# EAGLE design BeeMonitor (EAGLE 7.7.0)
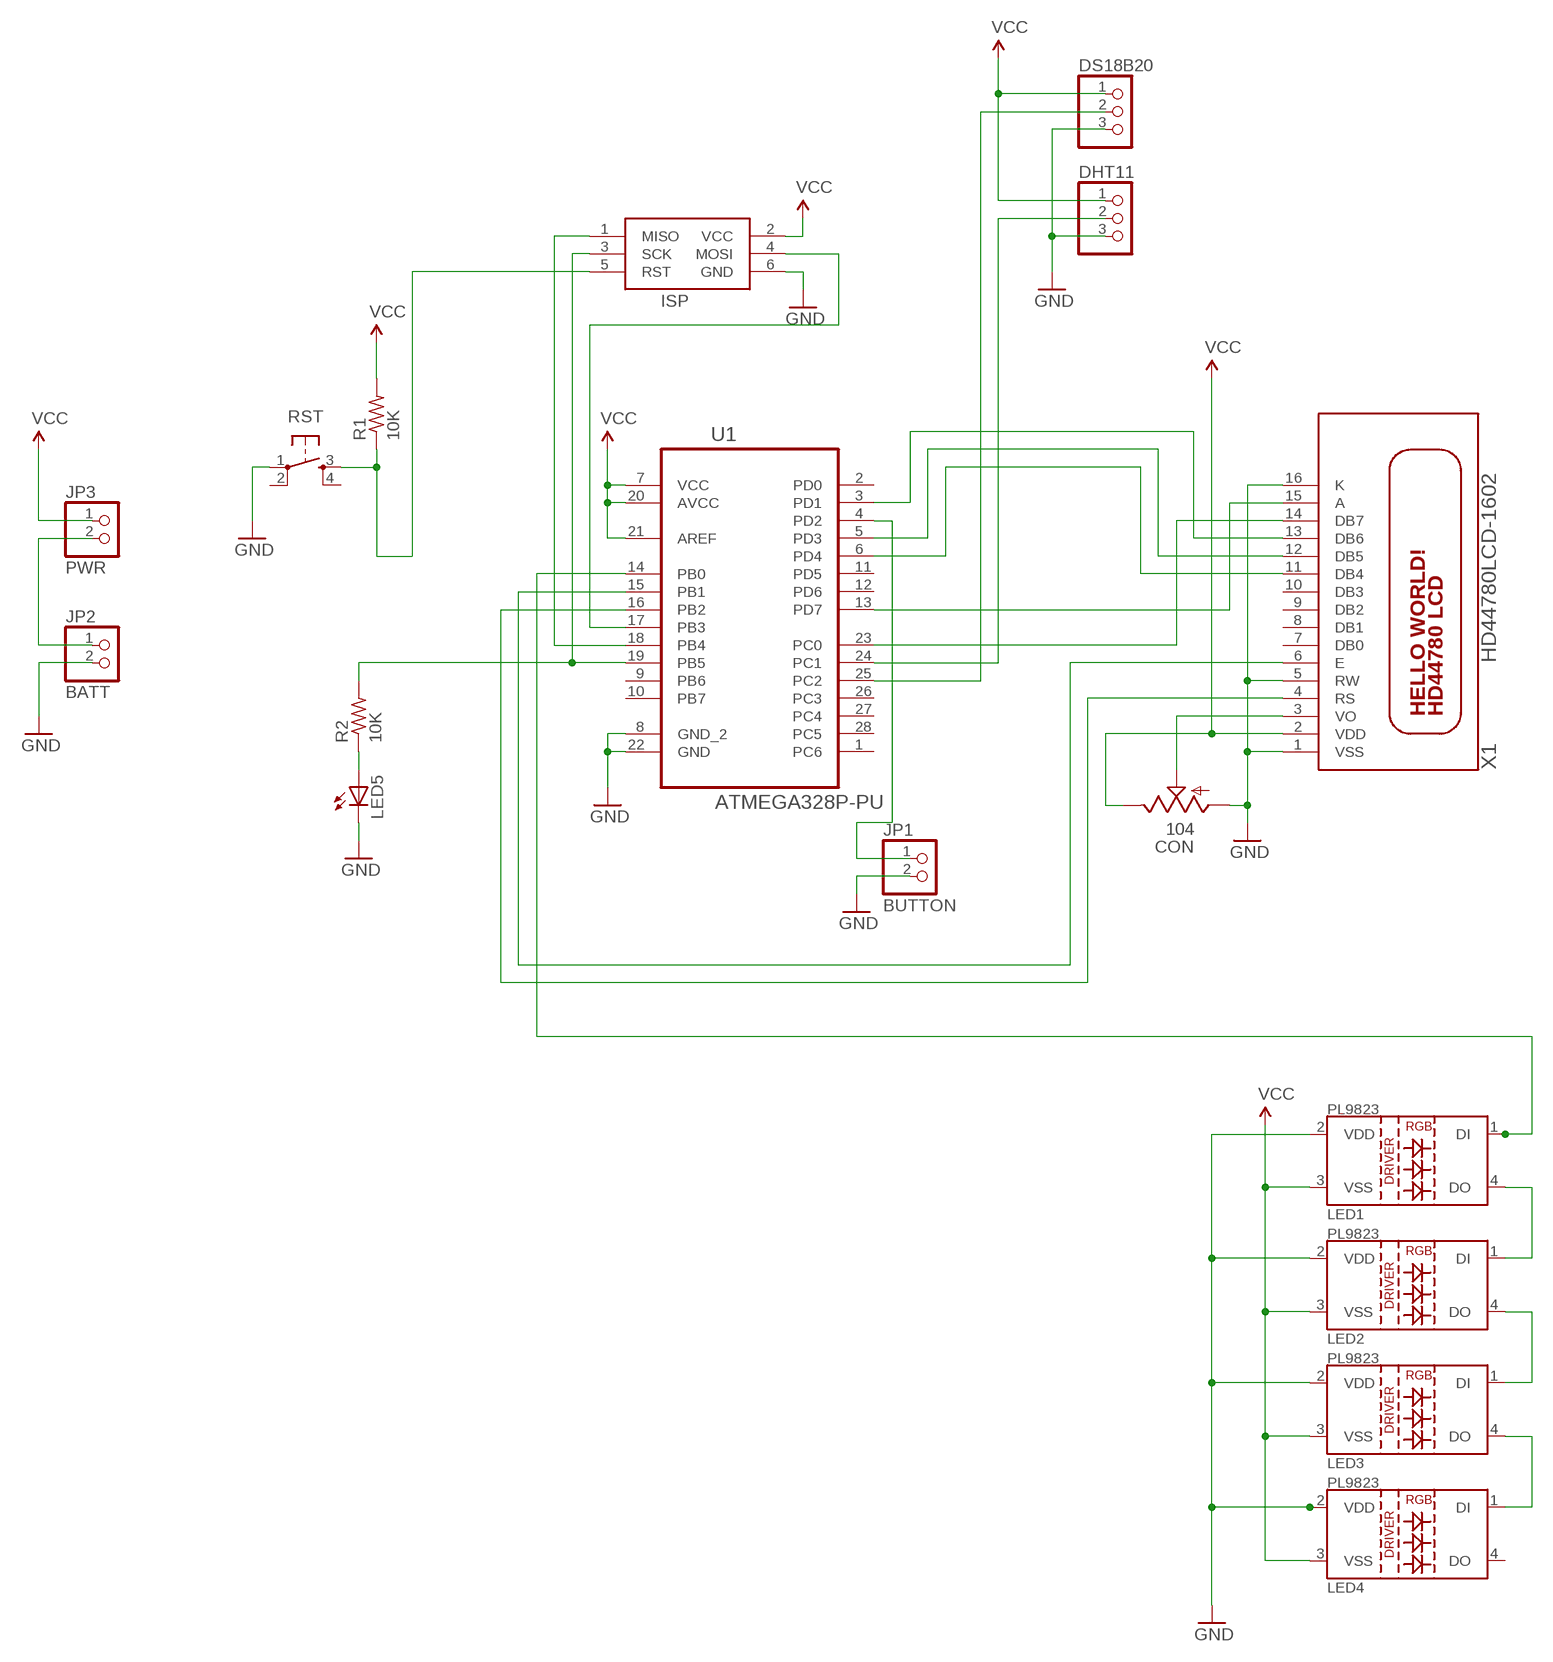
[diagram p0: schematic, sheet 1]

## Parts
CON  104  TRIM  [6MM]
DHT11  PINHD-1X3  [1X03]
DS18B20  PINHD-1X3  [1X03]
ISP  AVRISP-6  [AVRISP]
JP1  BUTTON  PINHD-1X2  [1X02]
JP2  BATT  PINHD-1X2  [1X02]
JP3  PWR  PINHD-1X2  [1X02]
LED1  LED-PL9823-F5  [LED-PL9823-F5]
LED2  LED-PL9823-F5  [LED-PL9823-F5]
LED3  LED-PL9823-F5  [LED-PL9823-F5]
LED4  LED-PL9823-F5  [LED-PL9823-F5]
LED5  LED3MM  [LED3MM]
R1  10K  R-US_0207/10  [0207/10]
R2  10K  R-US_0207/10  [0207/10]
RST  TAC_SWITCHPTH  [TACTILE-PTH]
U1  ATMEGA328P-PU  [DIP254P762X457-28]
X1  HD44780LCD-1602  [LCD1602]

## Nets
GND: DHT11.3 DS18B20.3 ISP.6(GND) JP1.2 JP2.2 LED1.2(VDD) LED2.2(VDD) LED3.2(VDD) LED4.2(VDD) LED5.K(C) RST.1 U1.8(GND_2) U1.22(GND)
N$1: CON.S X1.3(VO)
N$2: ISP.5(RST) R1.1 RST.3
N$3: ISP.3(SCK) R2.2 U1.19(PB5)
N$4: ISP.1(MISO) U1.18(PB4)
N$5: ISP.4(MOSI) U1.17(PB3)
N$6: LED1.4(DO) LED2.1(DI)
N$7: LED2.4(DO) LED3.1(DI)
N$8: LED3.4(DO) LED4.1(DI)
N$9: LED1.1(DI) U1.14(PB0)
N$10: U1.3(PD1) X1.13(DB6)
N$11: DHT11.2 U1.24(PC1)
N$12: DS18B20.2 U1.25(PC2)
N$13: JP1.1 U1.4(PD2)
N$14: U1.13(PD7) X1.15(A)
N$15: U1.23(PC0) X1.14(DB7)
N$16: U1.5(PD3) X1.12(DB5)
N$17: U1.6(PD4) X1.11(DB4)
N$18: U1.15(PB1) X1.6(E)
N$19: U1.16(PB2) X1.4(RS)
N$20: LED5.A R2.1
N$21: JP2.1 JP3.2
VCC: DHT11.1 DS18B20.1 ISP.2(VCC) JP3.1 LED1.3(VSS) LED2.3(VSS) LED3.3(VSS) LED4.3(VSS) R1.2 U1.7(VCC) U1.20(AVCC) U1.21(AREF)
VDD: CON.E X1.2(VDD) ; supply symbol labelled VCC
VSS: CON.A X1.1(VSS) X1.5(RW) X1.16(K) ; supply symbol labelled GND
Unconnected: LED4.4(DO) RST.2 RST.4 U1.1(PC6) U1.2(PD0) U1.9(PB6) U1.10(PB7) U1.11(PD5) U1.12(PD6) U1.26(PC3) U1.27(PC4) U1.28(PC5) X1.7(DB0) X1.8(DB1) X1.9(DB2) X1.10(DB3)

## Library data of the parts
CON = adafruit:TRIM
DHT11 DS18B20 = adafruit:PINHD-1X3: PIN HEADER
ISP = adafruit:AVRISP: AVR ISP HEADER Standard 6 pin header for AVR programming
JP1-JP3 = pinhead:PINHD-1X2: PIN HEADER
LED1-LED4 = Ai_LED:LED-PL9823
LED5 = adafruit:LED: LED OSRAM: - CHIPLED LG R971, LG N971, LY N971, LG Q971, LY Q971, LO R971, LY R971 LH N974, LH R974 LS Q976, LO Q976, LY Q976 LO Q996 - Hyper CHIPLED LW Q18S LB Q993, LB Q99A, LB R99A - SideLED LS A670, LO A670, LY A670, LG A670, LP A670 LB A673, LV A673, LT A673, LW A673 LH A674 LY A675 LS A676, LA A676, LO A676, LY A676, LW A676 LS A679, LY A679, LG A679 - Hyper Micro SIDELED® LS Y876, LA Y876, LO Y876, LY Y876 LT Y87S - SmartLED LW L88C, LW L88S LB L89C, LB L89S, LG L890 LS L89K, LO L89K, LY L89K LS L896, LA L896, LO L896, LY L896 - TOPLED LS T670, LO T670, LY T670, LG T670, LP T670 LSG T670, LSP T670, LSY T670, LOP T670, LYG T670 LG T671, LOG T671, LSG T671 LB T673, LV T673, LT T673, LW T673 LH T674 LS T676, LA T676, LO T676, LY T676, LB T676, LH T676, LSB T676, LW T676 LB T67C, LV T67C, LT T67C, LS T67K, LO T67K, LY T67K, LW E67C LS E67B, LA E67B, LO E67B, LY E67B, LB E67C, LV E67C, LT E67C LW T67C LS T679, LY T679, LG T679 LS T770, LO T770, LY T770, LG T770, LP T770 LB T773, LV T773, LT T773, LW T773 LH T774 LS E675, LA E675, LY E675, LS T675 LS T776, LA T776, LO T776, LY T776, LB T776 LHGB T686 LT T68C, LB T68C - Hyper Mini TOPLED® LB M676 - Mini TOPLED Santana® LG M470 LS M47K, LO M47K, LY M47K Source: http://www.osram.convergy.de/
R1 R2 = adafruit:R-US_: RESISTOR, American symbol
RST = SparkFun:TAC_SWITCH: Momentary Switch Button commonly used for reset or general input. Spark Fun Electronics SKU : COM-00097
U1 = Atmel_By_element14_Batch_1-00:ATMEGA328P-PU: 8-bit Microcontroller with In-System Programmable Flash; MPN: ATMEGA328P-PU; OC_FARNELL: 1715487; OC_NEWARK: 15R0268; PACKAGE: PDIP-28; SUPPLIER: Atmel
X1 = adafruit:HD44780LCD: HD44780 LCD Standard character type LCDs, available in sizes from 8x1 to 40x4!

## Board
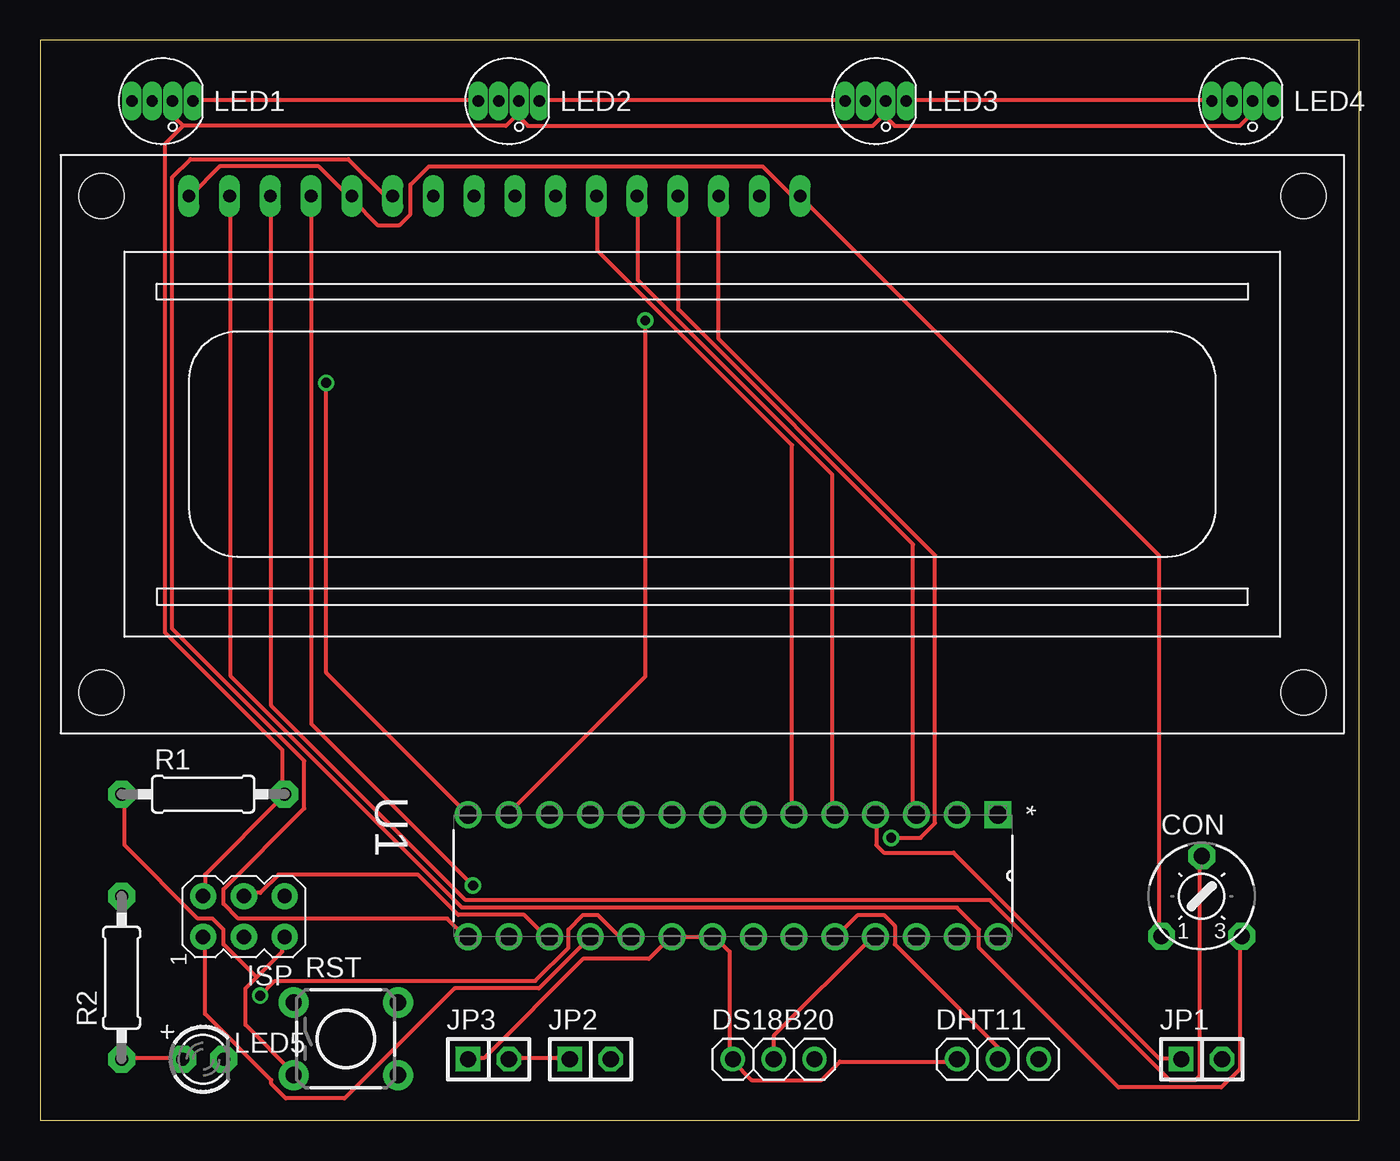
[diagram p1: board, top side]
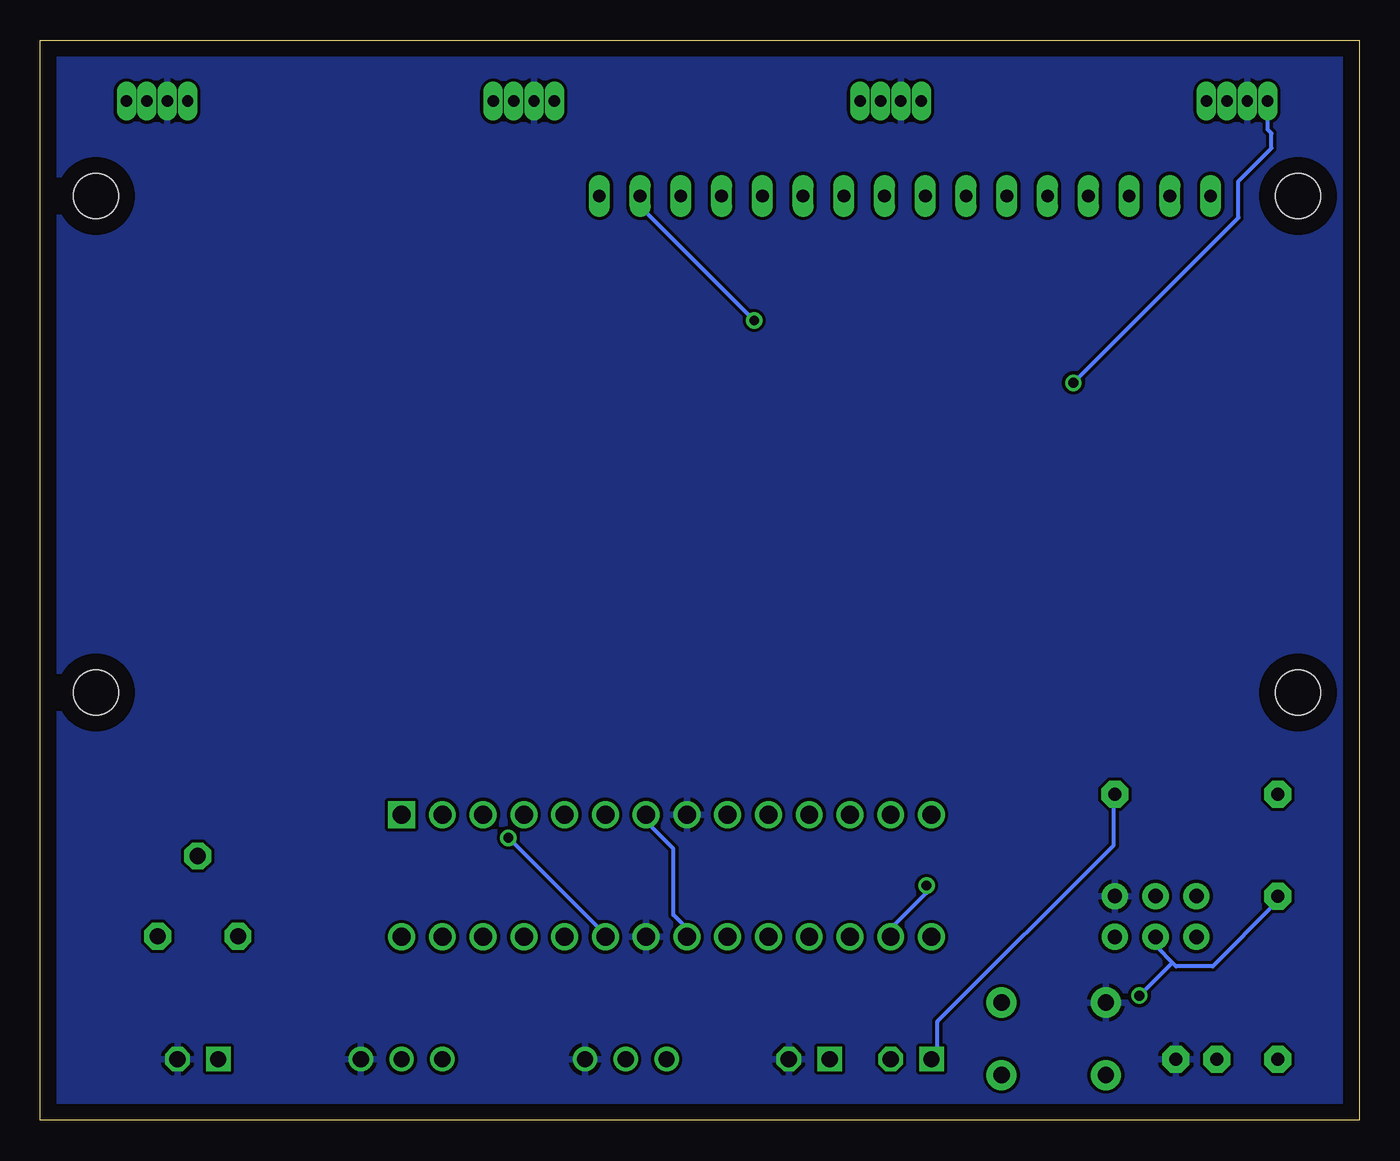
[diagram p2: board, bottom side, seen from below]

Size 82.22 x 67.3 mm. Coordinates in mm from the lower left corner, seen from the top.
Outline: 0,0 82.22,0 82.22,67.3 0,67.3 0,0
Copper layers (1*16): Top 0.035mm / dielectric 1.5mm / Bottom 0.035mm
Design rules "default": minimum track width 10mil, minimum drill 24mil, track to track 8mil, track to pad 8mil, pad to pad 8mil, via to via 8mil, smd to smd 8mil, copper to edge 40mil, drill to drill 8mil, minimum pad ring 10mil, minimum via ring 8mil, stop-mask expansion 4mil, vias tented up to drill 0mil, thermal gap 10mil

### Footprints (pad centres in the part's own frame; a part is rotated, then mirrored left to right if it is on the bottom)
6MM = drill 1 pad 1.676 octagon: A -2.5,-2.5; E 2.5,-2.5; S 0,2.5
1X03 = drill 1.016: 1 -2.54,0; 2 0,0; 3 2.54,0
AVRISP = drill 0.9 pad 1.626: 1 -1.27,2.54; 2 1.27,2.54; 3 -1.27,0; 4 1.27,0; 5 -1.27,-2.54; 6 1.27,-2.54
1X02 = drill 1.016 square: 1 -1.27,0 | drill 1.016 octagon: 2 1.27,0
LED-PL9823-F5 = drill 0.711 pad 0.889 long: 1 -1.905,0; 2 -0.635,0; 3 0.635,0; 4 1.905,0
LED3MM = drill 0.813 pad 1.676 octagon: A -1.27,0; K 1.27,0
0207/10 = drill 0.813 pad 1.676 octagon: 1 -5.08,0; 2 5.08,0
TACTILE-PTH = drill 1.016 pad 1.88: 1 -3.251,2.261; 2 3.251,2.261; 3 -3.251,-2.261; 4 3.251,-2.261
DIP254P762X457-28 = drill 1.118 square: 1 -7.62,33.02 | drill 1.118: 2 -7.62,30.48; 3 -7.62,27.94; 4 -7.62,25.4; 5 -7.62,22.86; 6 -7.62,20.32; 7 -7.62,17.78; 8 -7.62,15.24; 9 -7.62,12.7; 10 -7.62,10.16; 11 -7.62,7.62; 12 -7.62,5.08; 13 -7.62,2.54; 14 -7.62,0; 15 0,0; 16 0,2.54; 17 0,5.08; 18 0,7.62; 19 0,10.16; 20 0,12.7; 21 0,15.24; 22 0,17.78; 23 0,20.32; 24 0,22.86; 25 0,25.4; 26 0,27.94; 27 0,30.48; 28 0,33.02
LCD1602 = drill 0.8 long: 1 8,33.46; 2 10.54,33.46; 3 13.08,33.46; 4 15.62,33.46; 5 18.16,33.46; 6 20.7,33.46; 7 23.24,33.46; 8 25.78,33.46; 9 28.32,33.46; 10 30.86,33.46; 11 33.4,33.46; 12 35.94,33.46; 13 38.48,33.46; 14 41.02,33.46; 15 43.56,33.46; 16 46.1,33.46 | hole 2.8: 2.54,2.54; 2.54,33.46; 77.46,33.46; 77.46,2.54

### Placement (x,y rotation side)
CON  72.39,13.97 0 top
DHT11  59.69,3.81 0 top
DS18B20  45.72,3.81 0 top
ISP  12.7,12.7 90 top
JP1  72.39,3.81 0 top
JP2  34.29,3.81 0 top
JP3  27.94,3.81 0 top
LED1  7.62,63.5 0 top
LED2  29.21,63.5 0 top
LED3  52.07,63.5 0 top
LED4  74.93,63.5 0 top
LED5  10.16,3.81 0 top
R1  10.16,20.32 0 top
R2  5.08,8.89 90 top
RST  19.05,5.08 0 top
U1  26.67,11.43 270 top
X1  1.27,24.13 0 top

### Tracks (layer width: path | path; a pad name or v marks a point on that pad's centre or on a via)
GND
  pour Bottom: -1.27,-1.27 83.82,-1.27 83.82,68.58 -1.27,68.58
N$1
  Top 0.254: X1.3 14.4,57.38 14.4,25.83 26.52,13.72 59.21,13.72 70.41,2.52 72.01,2.52 72.24,2.74 72.24,16.46 CON.S
N$2
  Top 0.254: 13.49,8.91 12.8,8.23 12.8,5.94 15.77,2.97 RST.3 | 13.49,8.91 15.09,10.52 15.09,11.43 ISP.5 | 13.49,8.91 11.43,10.97 11.43,11.89 10.74,12.57 9.83,12.57 5.26,17.14 5.26,20.12 R1.1
N$3  (via drill 0.61)
  Top 0.254: U1.19 36.12,11.43 34.75,12.8 33.83,12.8 32.92,11.89 32.92,10.74 30.86,8.69 14.63,8.69 v13.72,7.77
  Bottom 0.254: 11.66,9.83 11.43,9.6 9.14,9.6 5.26,13.49 5.26,13.95 R2.2 | 11.66,9.83 12.57,10.74 12.57,11.43 ISP.3 | 11.66,9.83 v13.72,7.77
N$4
  Top 0.254: U1.18 31.09,8.23 25.83,8.23 18.97,1.37 15.32,1.37 14.4,2.29 14.4,2.52 10.29,6.63 10.29,11.43 ISP.1
N$5
  Top 0.254: ISP.4 12.8,14.17 13.72,14.17 14.86,15.32 23.55,15.32 26.06,12.8 30.18,12.8 31.55,11.43 U1.17
N$6
  Top 0.254: LED1.4 9.6,63.55 27.2,63.55 LED2.1
N$7
  Top 0.254: LED2.4 31.32,63.55 50.06,63.55 LED3.1
N$8
  Top 0.254: LED3.4 54.18,63.55 72.92,63.55 LED4.1
N$9  (via drill 0.61)
  Top 0.254: v17.83,45.95 17.83,27.89 U1.14
  Bottom 0.254: LED1.1 5.71,61.72 5.49,61.49 5.49,60.58 7.54,58.52 7.54,56.24 v17.83,45.95
N$10
  Top 0.254: X1.13 39.78,57.38 39.78,50.52 54.41,35.89 54.41,19.2 U1.3
N$11
  Top 0.254: DHT11.2 59.66,3.89 59.66,4.57 53.26,10.97 53.26,12.12 52.58,12.8 50.98,12.8 49.61,11.43 U1.24
N$12
  Top 0.254: DS18B20.2 45.72,5.26 51.89,11.43 U1.25
N$13
  Top 0.254: JP1.1 71.09,3.89 69.72,3.89 56.92,16.69 52.58,16.69 52.12,17.14 52.12,18.97 U1.4
N$14  (via drill 0.61)
  Top 0.254: v37.72,49.84 37.72,27.66 29.26,19.2 U1.13
  Bottom 0.254: v37.72,49.84 44.81,56.92 44.81,57.38 X1.15
N$15  (via drill 0.61)
  Top 0.254: v53.03,17.6 54.86,17.6 55.78,18.52 55.78,35.2 42.29,48.69 42.29,57.38 X1.14
  Bottom 0.254: v53.03,17.6 46.86,11.43 U1.23
N$16
  Top 0.254: X1.12 37.26,57.38 37.26,52.35 49.38,40.23 49.38,19.2 U1.5
N$17
  Top 0.254: X1.11 34.75,57.38 34.75,54.18 46.86,42.06 46.86,19.2 U1.6
N$18
  Top 0.254: X1.6 21.95,57.61 21.49,57.61 19.2,59.89 9.37,59.89 8.23,58.75 8.23,30.63 16.46,22.4 16.46,19.43 11.43,14.4 11.43,13.49 12.34,12.57 25.38,12.57 26.52,11.43 U1.15
N$19  (via drill 0.61)
  Top 0.254: v26.98,14.63 16.92,24.69 16.92,57.38 X1.4
  Bottom 0.254: v26.98,14.63 26.98,14.17 29.03,12.12 29.03,11.43 U1.16
N$20
  Top 0.254: R2.1 5.26,3.89 8.69,3.89 LED5.A
N$21
  Top 0.254: JP3.2 29.26,3.89 32.92,3.89 JP2.1
VCC
  Top 0.254: DHT11.1 57.15,3.66 49.84,3.66 48.69,2.52 44.35,2.52 43.2,3.66 DS18B20.1 42.98,3.89 42.98,10.52 42.06,11.43 U1.21 U1.20 39.32,11.43 37.95,10.06 33.83,10.06 27.66,3.89 26.75,3.89 JP3.1 | ISP.2 10.29,14.17 10.29,15.32 15.09,20.12 R1.2 15.09,20.34 15.09,23.09 7.77,30.4 7.77,60.81 8.91,61.95 | 8.91,61.95 8.46,62.41 8.46,63.32 LED1.3 | 8.91,61.95 29.03,61.95 29.72,62.64 | 29.72,62.64 29.72,63.32 LED2.3 29.72,62.64 | 52.58,62.64 52.58,63.32 LED3.3 52.58,62.64 | 52.58,62.64 51.89,61.95 30.4,61.95 29.72,62.64 | 52.58,62.64 53.26,61.95 74.75,61.95 75.44,62.64 75.44,63.32 LED4.3
  Bottom 0.254: U1.7 44.35,18.97 44.35,18.52 42.75,16.92 42.75,12.8 42.06,12.12 42.06,11.43 U1.21 | R1.2 15.32,20.12 15.32,17.14 26.29,6.17 26.29,4.12 26.52,3.89 JP3.1
VDD
  Top 0.254: X1.2 11.89,57.38 11.89,27.66 26.29,13.26 57.15,13.26 58.52,11.89 58.52,10.74 67.21,2.06 73.61,2.06 74.75,3.2 74.75,11.43 CON.E
VSS
  Top 0.254: X1.1 9.37,57.61 11.2,59.44 17.37,59.44 19.2,57.61 X1.5 19.43,57.38 21.03,55.78 22.4,55.78 23.09,56.46 23.09,58.29 24.23,59.44 45.03,59.44 46.86,57.61 47.32,57.61 X1.16 47.55,57.38 69.72,35.2 69.72,11.66 CON.A